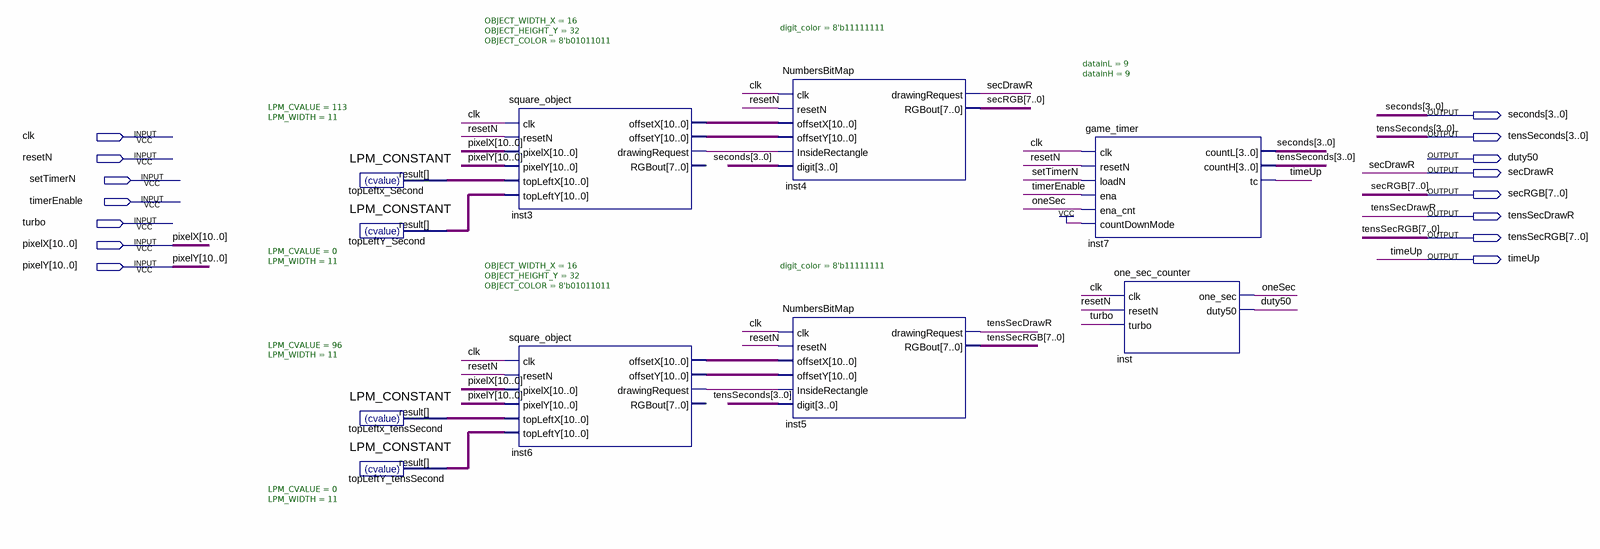
[diagram p0: schematic sheet]
// Quartus schematic timerTop.bdf as structural Verilog: 10 symbols, 15 pins
module timerTop (
  input  clk,
  input  resetN,
  input  setTimerN,
  input  timerEnable,
  input  turbo,
  input  [10:0] pixelX,
  input  [10:0] pixelY,
  output [3:0] seconds,
  output [3:0] tensSeconds,
  output duty50,
  output secDrawR,
  output [7:0] secRGB,
  output tensSecDrawR,
  output [7:0] tensSecRGB,
  output timeUp
);

  wire inst3_drawingrequest, inst6_drawingrequest, oneSec;
  wire [10:0] inst3_offsetx, inst3_offsety, inst6_offsetx, inst6_offsety, topLeftx_Second_result,
       topLeftx_tensSecond_result, topLeftY_Second_result, topLeftY_tensSecond_result;

  LPM_CONSTANT #(.LPM_CVALUE(113), .LPM_WIDTH(11)) topLeftx_Second (.result(topLeftx_Second_result));
  LPM_CONSTANT #(.LPM_CVALUE(0), .LPM_WIDTH(11)) topLeftY_Second (.result(topLeftY_Second_result));
  LPM_CONSTANT #(.LPM_CVALUE(96), .LPM_WIDTH(11)) topLeftx_tensSecond (.result(topLeftx_tensSecond_result));
  LPM_CONSTANT #(.LPM_CVALUE(0), .LPM_WIDTH(11)) topLeftY_tensSecond (.result(topLeftY_tensSecond_result));
  square_object #(.OBJECT_WIDTH_X(16), .OBJECT_HEIGHT_Y(32), .OBJECT_COLOR(8'b01011011)) inst3 (
    .clk(clk), .resetN(resetN), .pixelX(pixelX), .pixelY(pixelY), .topLeftX(topLeftx_Second_result),
    .topLeftY(topLeftY_Second_result), .offsetX(inst3_offsetx), .offsetY(inst3_offsety),
    .drawingRequest(inst3_drawingrequest));  // open: RGBout
  square_object #(.OBJECT_WIDTH_X(16), .OBJECT_HEIGHT_Y(32), .OBJECT_COLOR(8'b01011011)) inst6 (
    .clk(clk), .resetN(resetN), .pixelX(pixelX), .pixelY(pixelY), .topLeftX(topLeftx_tensSecond_result),
    .topLeftY(topLeftY_tensSecond_result), .offsetX(inst6_offsetx), .offsetY(inst6_offsety),
    .drawingRequest(inst6_drawingrequest));  // open: RGBout
  NumbersBitMap #(.digit_color(8'b11111111)) inst4 (
    .clk(clk), .resetN(resetN), .offsetX(inst3_offsetx), .offsetY(inst3_offsety),
    .InsideRectangle(inst3_drawingrequest), .digit(seconds), .drawingRequest(secDrawR), .RGBout(secRGB));
  NumbersBitMap #(.digit_color(8'b11111111)) inst5 (
    .clk(clk), .resetN(resetN), .offsetX(inst6_offsetx), .offsetY(inst6_offsety),
    .InsideRectangle(inst6_drawingrequest), .digit(tensSeconds), .drawingRequest(tensSecDrawR),
    .RGBout(tensSecRGB));
  game_timer #(.datainL(9), .datainH(9)) inst7 (
    .clk(clk), .resetN(resetN), .loadN(setTimerN), .ena(timerEnable), .ena_cnt(oneSec), .countDownMode(1'b1),
    .countL(seconds), .countH(tensSeconds), .tc(timeUp));
  one_sec_counter inst (.clk(clk), .resetN(resetN), .turbo(turbo), .one_sec(oneSec), .duty50(duty50));
endmodule
